# EAGLE schematic Adafruit NeoPixel JST SH Breakout (EAGLE 9.6.2)
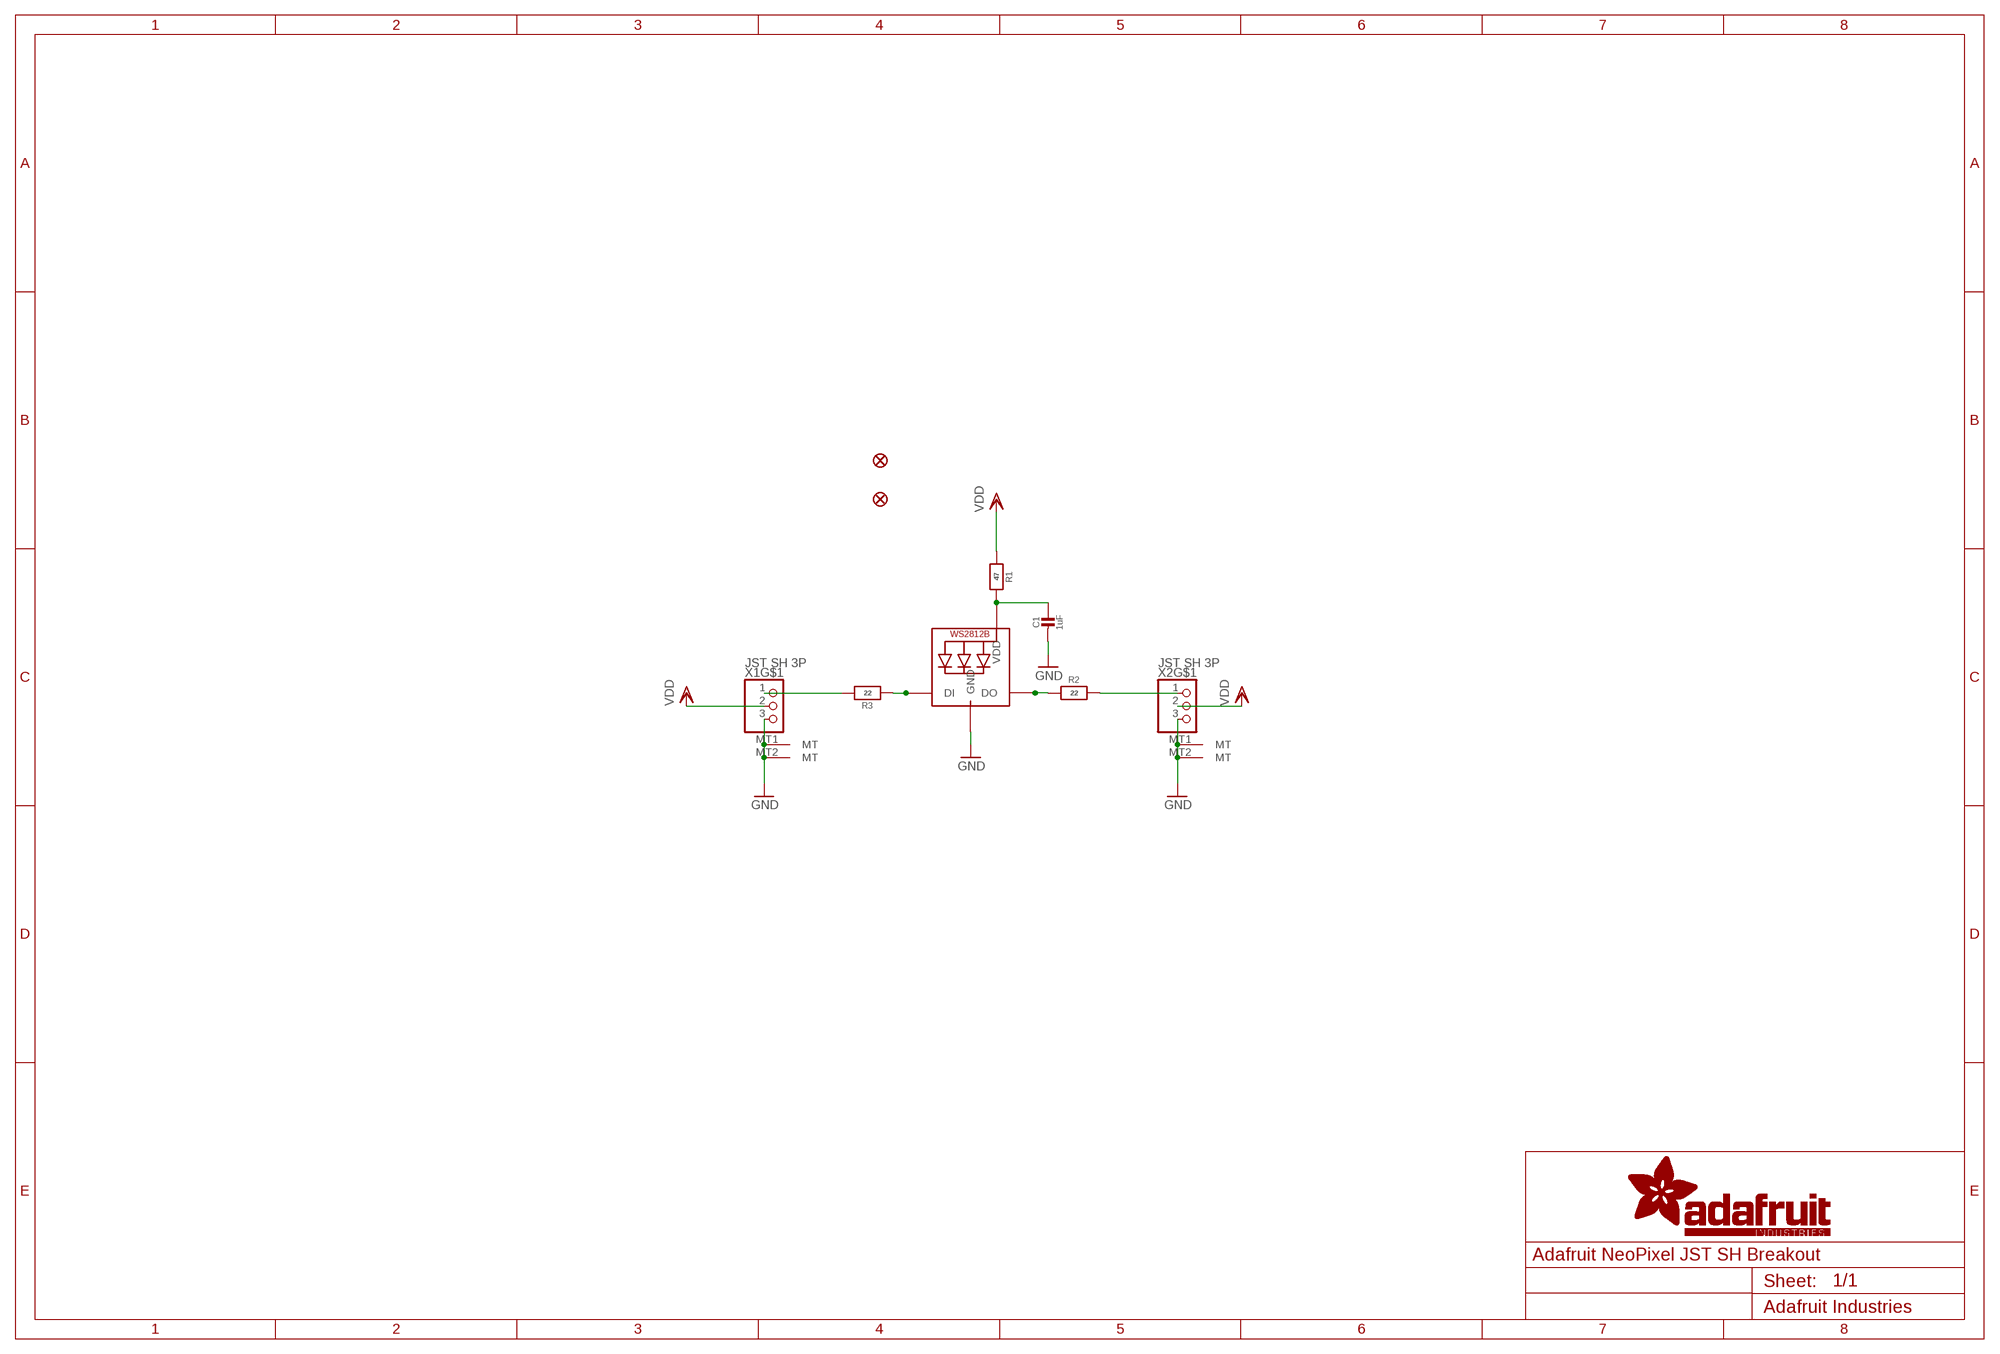
[diagram p0: schematic, sheet 1]

## Parts
C1  1uF  CAP_CERAMIC0603_NO  [0603-NO]
FID1  FIDUCIAL_0.5MM  [FIDUCIAL_0.5MM]
FID2  FIDUCIAL_0.5MM  [FIDUCIAL_0.5MM]
LED2  WS2812B_5050N  [WS2812B-NARROW]
R1  47  RESISTOR_0402NO  [_0402NO]
R2  22  RESISTOR_0402NO  [_0402NO]
R3  22  RESISTOR_0402NO  [_0402NO]
X1  JST SH 3P  CON_JST_SH_3PINHORZ  [JST_SH3]
X2  JST SH 3P  CON_JST_SH_3PINHORZ  [JST_SH3]

## Nets
GND: C1.2 LED2.3-GND(GND) X1.3 X1.MT1(MT) X1.MT2(MT) X2.3 X2.MT1(MT) X2.MT2(MT)
IN: R3.2 X1.1
N$1: LED2.2-DOUT(DO) R2.1
N$2: LED2.4-DIN(DI) R3.1
N$3: C1.1 LED2.1-VDD(VDD) R1.2
OUT: R2.2 X2.1
VDD: R1.1 X1.2 X2.2

## Library data of the parts
C1 = microbuilder:CAP_CERAMIC: Ceramic Capacitors For new designs, use the packages preceded by an '_' character since they are more reliable: The following footprints should be used on most boards: _0402 - Standard footprint for regular board layouts _0603 - Standard footprint for regular board layouts _0805 - Standard footprint for regular board layouts _1206 - Standard footprint for regular board layouts For extremely tight-pitch boards where space is at a premium, the following 'micro-pitch' footprints can be used (smaller pads, no silkscreen outline, etc.): _0402MP - Micro-pitch footprint for very dense/compact boards _0603MP - Micro-pitch footprint for very dense/compact boards _0805MP - Micro-pitch footprint for very dense/compact boards _1206MP - Micro-pitch footprint for very dense/compact boards
FID1 FID2 = microbuilder:FIDUCIAL: Fiducial Alignment Points Various fiducial points for machine vision alignment.
LED2 = microbuilder:WS2812B
R1-R3 = microbuilder:RESISTOR: Resistors For new designs, use the packages preceded by an '_' character since they are more reliable: The following footprints should be used on most boards: _0402 - Standard footprint for regular board layouts _0603 - Standard footprint for regular board layouts _0805 - Standard footprint for regular board layouts _1206 - Standard footprint for regular board layouts For extremely tight-pitch boards where space is at a premium, the following 'micro-pitch' footprints can be used (smaller pads, no silkscreen outline, etc.): _0402MP - Micro-pitch footprint for very dense/compact boards _0603MP - Micro-pitch footprint for very dense/compact boards _0805MP - Micro-pitch footprint for very dense/compact boards _1206MP - Micro-pitch footprint for very dense/compact boards
X1 X2 = adafruit_electromech:CON_JST_SH_3PIN